# Altium schematic sheet ASIC_Interposer.SchDoc: ASIC Interposer
size A4; Date: 20.09.2023; ApprovedBy: Prof. Dr. Jens Anders; CheckedBy: M.Sc. Frederik Dreyer; Author: M.Sc. Tobias Wirth; CompanyName: IIS; DrawnBy: M.Sc. Tobias Wirth; Engineer: M.Sc. Tobias Wirth; Organization: Univertity of Stuttgart; Address1: Pfaffenwaldring 47; Address2: 70569 Stuttgart; Revision: V1.1; SheetNumber: 1; SheetTotal: 1; Project: Austrailia - NMR System; ENG_APP_DATE: --/--/--; DSN_APP_DATE: --/--/--; CHK_APP_DATE: --/--/--; ProjectNameAlt: AUS - NRM System; Time: 09:20
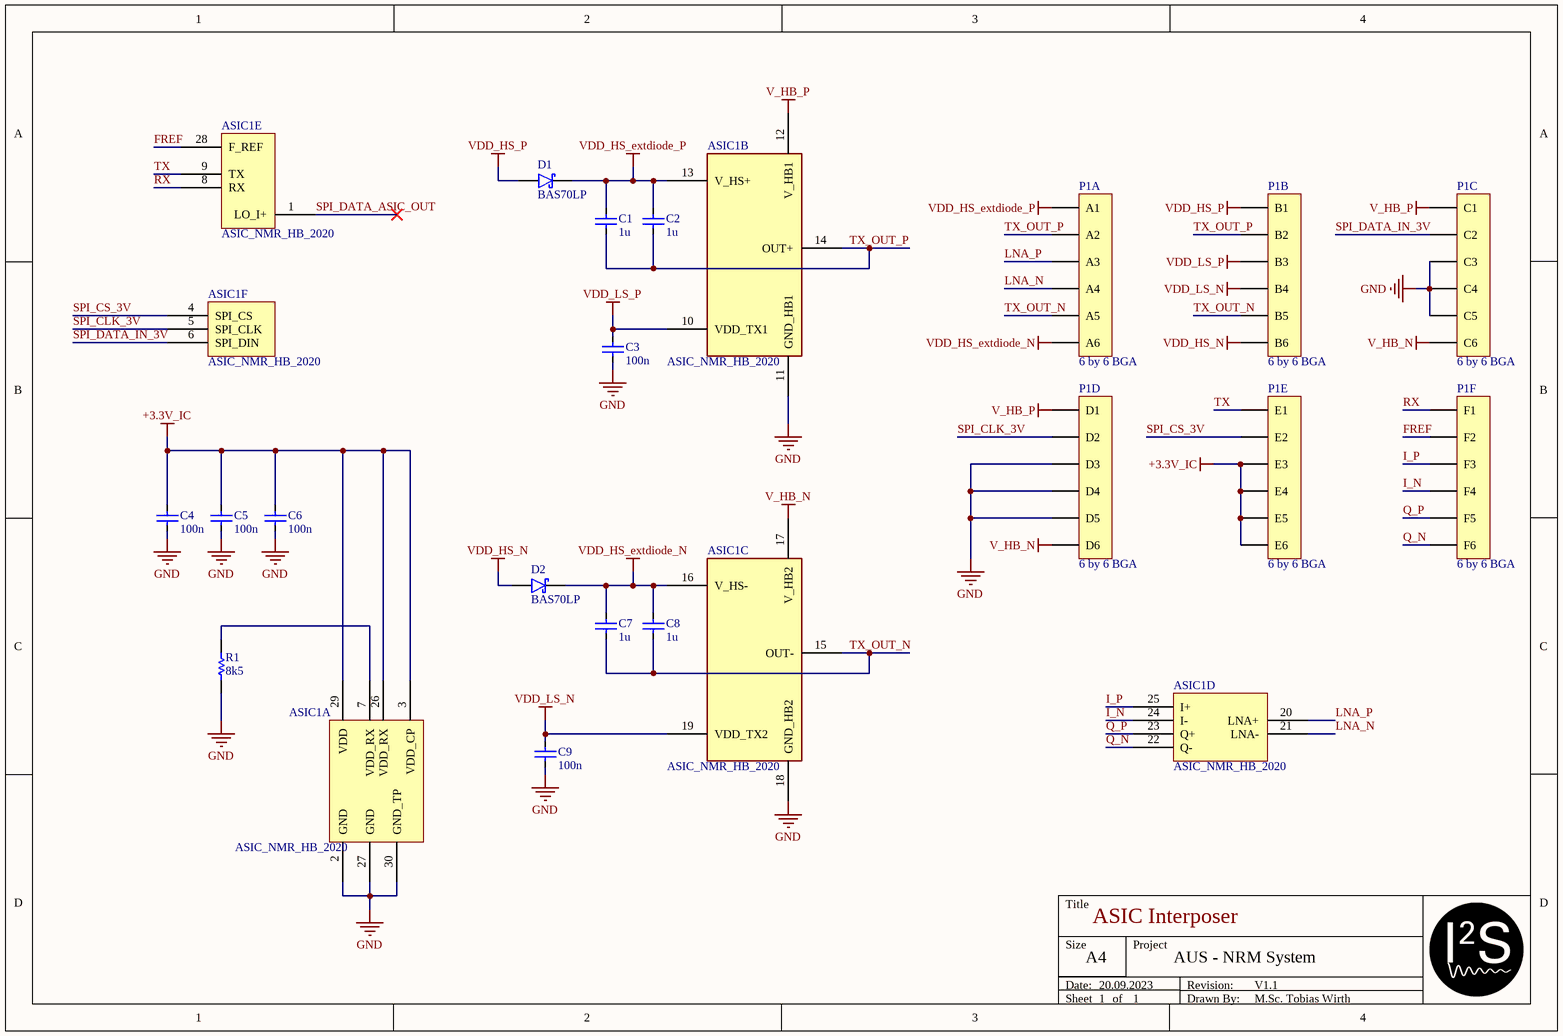
[diagram p0: ASIC_Interposer.SchDoc]

## Parts
ASIC1  ASIC_NMR_HB_2020  [ASIC_NMR_HB_2020]  (parts A,B,C,D,E,F of 6)
C1  1u  [CAP_0402]
C2  1u  [CAP_0402]
C3  100n  [CAP_0402]
C4  100n  [CAP_0402]
C5  100n  [CAP_0402]
C6  100n  [CAP_0402]
C7  1u  [CAP_0402]
C8  1u  [CAP_0402]
C9  100n  [CAP_0402]
D1  BAS70LP  [DFN65P101X53-2L]
D2  BAS70LP  [DFN65P101X53-2L]
P1  6 by 6 BGA  [BGA36C230P6X6_1500X1500X190 - ASIC]  (parts A,B,C,D,E,F of 6)
R1  8k5  [RES_0402]

## Nets
+3.3V_IC: ASIC1.3(VDD_CP) ASIC1.26(VDD_RX) ASIC1.29(VDD) C4.1 C5.1 C6.1 P1.E3 P1.E4 P1.E5 P1.E6
GND: ASIC1.2(GND) ASIC1.11(GND_HB1) ASIC1.18(GND_HB2) ASIC1.27(GND) ASIC1.30(GND_TP) C3.2 C4.2 C5.2 C6.2 C9.2 P1.C3 P1.C4 P1.C5 P1.D3 P1.D4 P1.D5 R1.1
V_HB_N: ASIC1.17(V_HB2) P1.C6 P1.D6
V_HB_P: ASIC1.12(V_HB1) P1.C1 P1.D1
VDD_HS_extdiode_N: ASIC1.16(V_HS-) C7.1 C8.1 D2.2 P1.A6
VDD_HS_extdiode_P: ASIC1.13(V_HS+) C1.1 C2.1 D1.2 P1.A1
VDD_HS_N: D2.1 P1.B6
VDD_HS_P: D1.1 P1.B1
VDD_LS_N: ASIC1.19(VDD_TX2) C9.1 P1.B4
VDD_LS_P: ASIC1.10(VDD_TX1) C3.1 P1.B3
FREF: ASIC1.28(F_REF) P1.F2
I_N: ASIC1.24(I-) P1.F4
I_P: ASIC1.25(I+) P1.F3
LNA_N: ASIC1.21(LNA-) P1.A4
LNA_P: ASIC1.20(LNA+) P1.A3
Q_N: ASIC1.22(Q-) P1.F6
Q_P: ASIC1.23(Q+) P1.F5
RX: ASIC1.8(RX) P1.F1
SPI_CLK_3V: ASIC1.5(SPI_CLK) P1.D2
SPI_CS_3V: ASIC1.4(SPI_CS) P1.E2
SPI_DATA_ASIC_OUT: ASIC1.1(LO_I+)
SPI_DATA_IN_3V: ASIC1.6(SPI_DIN) P1.C2
TX: ASIC1.9(TX) P1.E1
TX_OUT_N: ASIC1.15(OUT-) C7.2 C8.2 P1.A5 P1.B5
TX_OUT_P: ASIC1.14(OUT+) C1.2 C2.2 P1.A2 P1.B2
NetASIC1_7: ASIC1.7(VDD_RX) R1.2

## Notes on the sheet
- Title
- Size
- Date:
- Sheet
- A4
- of
- Project
- Drawn By:
- Revision:

## Library data of the parts
C1 C2 C7 C8 = Cap: 1µ @ 16V max.; Supplier: *; Part Number: *; Value: 1u
C3-C6 C9 = Cap: Supplier: *; Part Number: *; Value: 100n
D1 D2 = Schottky Diode
P1 = BGA_6x6
R1 = Res: Part Number: *; Supplier: *; Value: 8k5